# Altium schematic sheet AC-TO-DC-Input - Output Isolation.SchDoc
size A4
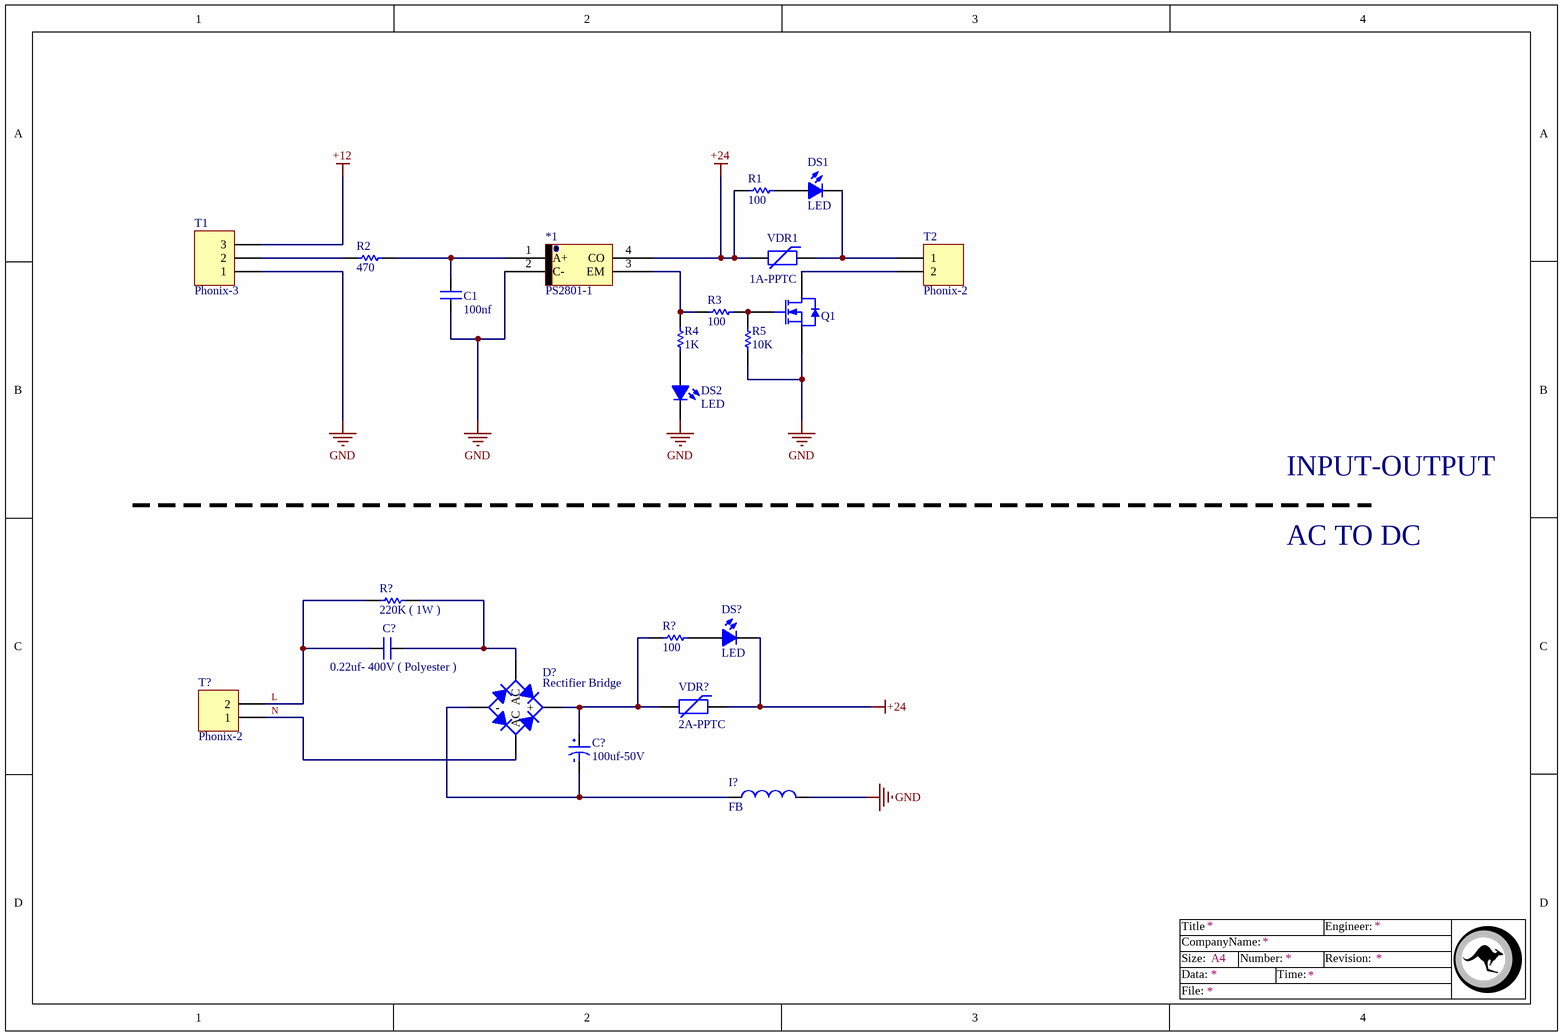
[diagram p0: AC-TO-DC-Input - Output Isolation.SchDoc]

## Parts
(Parts that share a designator on the sheet are numbered #1, #2 ... from top to bottom, then left to right.)
*1  PS2801-1  [PS2801-1]
C1  100nf  [Cap0805]
C?#1  0.22uf- 400V ( Polyester )  [Cap0805]
C?#2  100uf-50V  [Cap_5mm]
D?  Rectifier Bridge  [Bridge]
DS1  LED  [LED_SMD0805RED]
DS2  LED  [LED_SMD0805RED]
DS?  LED  [LED_SMD0805RED]
I?  FB  [1206]
Q1  MOSFET-N  [MOSFET-N]  (value not drawn)
R1  100  [R0805]
R2  470  [R0805]
R3  100  [R0805]
R4  1K  [R0805]
R5  10K  [R0805]
R?#1  220K ( 1W )  [R0805]
R?#2  100  [R0805]
T1  Phonix-3  [Phonix-3]
T2  Phonix-2  [Phonix-2]
T?  Phonix-2  [Phonix-2]
VDR1  1A-PPTC  [Varistor]
VDR?  2A-PPTC  [Varistor]

## Nets
+12: T1.3
+24: *1.4(CO) DS?.K R1.1 VDR1.1 VDR?.2
GND: *1.2(C-) C1.1 DS2.K I?.2 Q1.3 R5.2 T1.1
L: C?#1.1 R?#1.2 T?.2
N: D?.4(AC) T?.1
Net*1_1: *1.1(A+) C1.2 R2.1
Net*1_3: *1.3(EM) R3.2 R4.1
NetC?#1_2: C?#1.2 D?.2(AC) R?#1.1
NetC?#2_1: C?#2.1 D?.1(-) I?.1
NetC?#2_2: C?#2.2 D?.3(+) R?#2.1 VDR?.1
NetDS1_A: DS1.A R1.2
NetDS1_K: DS1.K T2.1 VDR1.2
NetDS2_A: DS2.A R4.2
NetDS?_A: DS?.A R?#2.2
NetQ1_1: Q1.1 R3.1 R5.1
NetQ1_4: Q1.4 T2.2
NetR2_2: R2.2 T1.2

## Notes on the sheet
- INPUT-OUTPUT
- AC TO DC
- Title
- Size:
- Data:
- CompanyName:
- A4
- Number:
- Time:
- Revision:
- Engineer:
- File:

## Library data of the parts
C1 C?#1 = Cap: Surface mount Capacitor
C?#2 = Cap_P: Polarity
I? = Inductor: Indicator
Q1 = MOSFET-N: MOSFET, N-Channel
R1-R5 R?#1 R?#2 = Resistor
T1 = Phonix-3: Connector
T2 T? = Phonix-2: Connector
VDR1 VDR? = Varistor